# EAGLE design Stepper_CANBus_V2 (EAGLE 9.5.2)
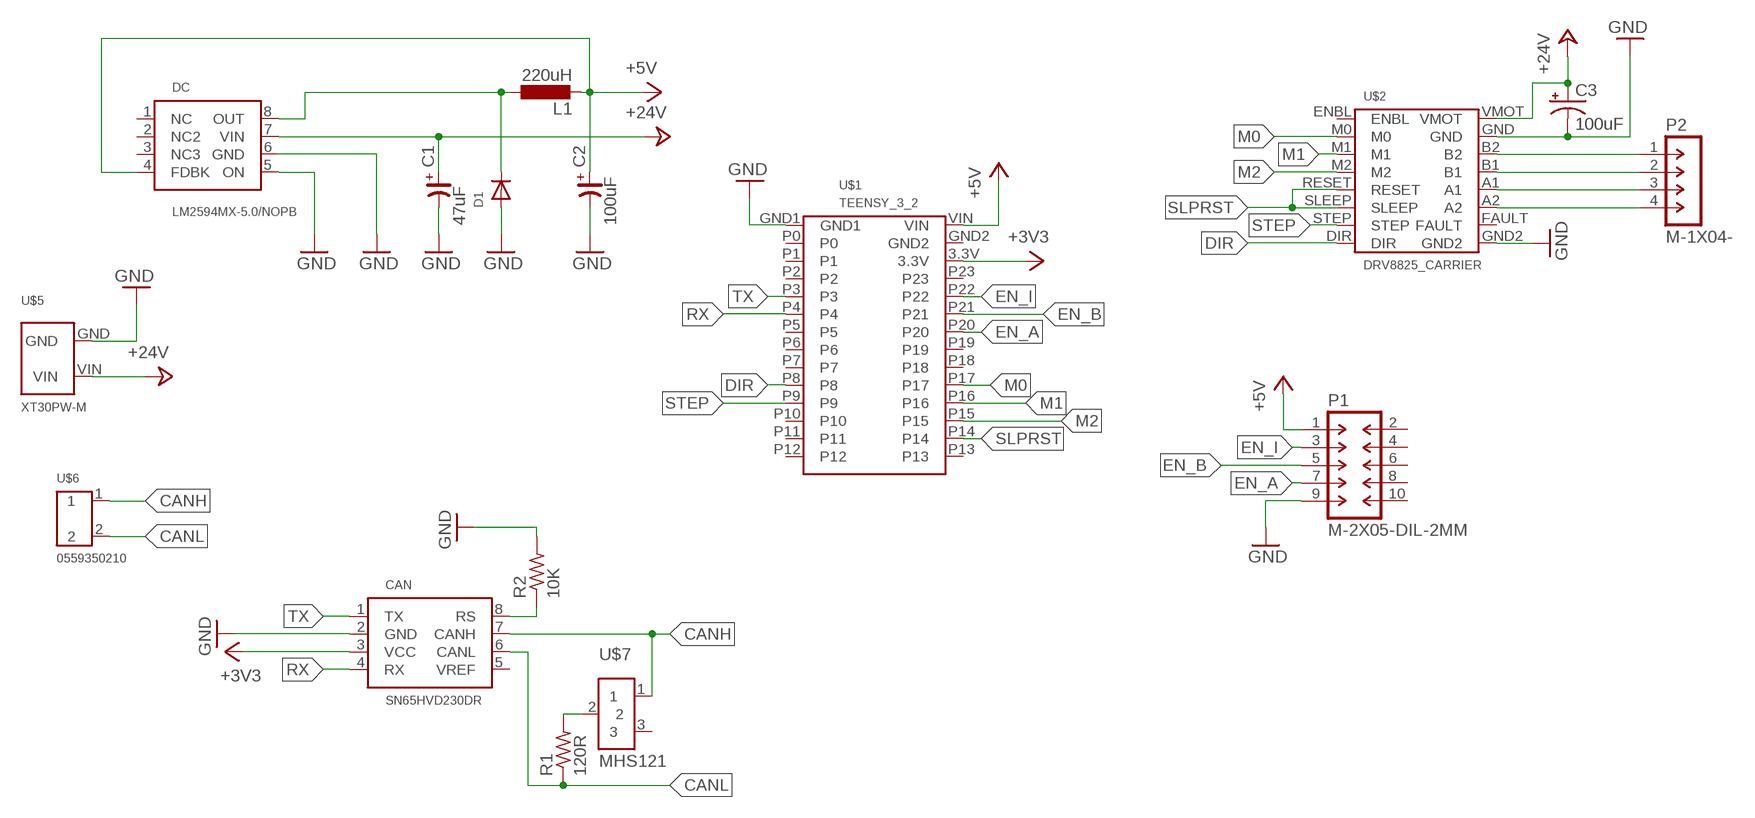
[diagram p0: schematic, sheet 1]

## Parts
C1  47uF  CP_7343  [C7343/T]
C2  100uF  CP_7343  [C7343/T]
C3  100uF  CPOL-USE2.5-7  [E2,5-7]
CAN  SN65HVD230DR  [SOIC8]
D1  DIODESOD-323F  [SOD-323F]
DC  LM2594MX-5.0/NOPB  [SOIC8]
L1  220uH  L-EUL4532C  [L4532M]
P1  M-2X05-DIL-2MM  [DIL-2MM-2X05]
P2  M-1X04-  [DIL-2MM-1X04]
R1  120R  R-US_R0603  [R0603]
R2  10K  R-US_R0603  [R0603]
U$1  TEENSY_3_2  [TEENSY_3_2]
U$2  DRV8825_CARRIER  [DRV8825_CARRIER]
U$5  XT30PW-M  [XT30PW-M]
U$6  0559350210  [0559350210]
U$7  MHS121  [MHS121]

## Nets
+3V3: CAN.3(VCC) U$1.3.3V
+5V: C2.+ DC.4(FDBK) L1.2 P1.1 U$1.VIN
+24V: C1.+ C3.+ DC.7(VIN) U$2.VMOT U$5.VIN
CANH: CAN.7(CANH) U$6.1 U$7.1
CANL: CAN.6(CANL) R1.1 U$6.2
DIR: U$1.P8 U$2.DIR
EN_A: P1.7 U$1.P20
EN_B: P1.5 U$1.P21
EN_I: P1.3 U$1.P22
GND: C1.- C2.- C3.- CAN.2(GND) D1.A DC.5(ON) DC.6(GND) P1.9 R2.2 U$1.GND1 U$2.GND U$2.GND2 U$5.GND
M0: U$1.P17 U$2.M0
M1: U$1.P16 U$2.M1
M2: U$1.P15 U$2.M2
N$1: CAN.8(RS) R2.1
N$2: D1.C DC.8(OUT) L1.1
N$3: P2.1 U$2.B2
N$4: R1.2 U$7.2
N$5: P2.2 U$2.B1
N$6: P2.3 U$2.A1
N$7: P2.4 U$2.A2
RX: CAN.4(RX) U$1.P4
SLPRST: U$1.P14 U$2.RESET U$2.SLEEP
STEP: U$1.P9 U$2.STEP
TX: CAN.1(TX) U$1.P3
Unconnected: CAN.5(VREF) DC.1(NC) DC.2(NC2) DC.3(NC3) P1.2 P1.4 P1.6 P1.8 P1.10 U$1.GND2 U$1.P0 U$1.P1 U$1.P2 U$1.P5 U$1.P6 U$1.P7 U$1.P10 U$1.P11 U$1.P12 U$1.P13 U$1.P18 U$1.P19 U$1.P23 U$2.ENBL U$2.FAULT U$7.3

## Library data of the parts
C1 C2 = rc-master:CP_: POLARIZED CAP
C3 = adafruit:CPOL-US: POLARIZED CAPACITOR, American symbol
CAN = Stepper_CANBus:SN65HVD230DR
D1 = adafruit:DIODE: Diode SMADIODE - SMA Surface Mount Package 20V 1A Schottky Diode Digikey: 641-1014-6-ND DO-1N4148 - Through Hole Small Current Diode SOD-123 20V 1 A (.5mV Vf) Schottky Diode - Digikey: MBRX120TPMSCT-ND SOD-323 10V 570mA (.38mV Vf, 3ns) Schottky Diode - Digikey: ZLLS410CT-ND SOD-523 30V 30mA Schottky Diode (RB751S-40TE61) - Digikey: RB751S-40TE61CT-ND SOT23-R/W - SOT23 Package (R = Solder Paste/Reflow Ovens, W = Hand-Soldering) BAT54Film 40V 300mA - Digikey: 497-7162-1-ND
DC = Stepper_CANBus:LM2594MX-5.0/NOPB
L1 = rcl:L-EU: INDUCTOR, European symbol; SPICEPREFIX: L
P1 = con-headers-jp:M-2X05-: MALE HEADER
P2 = con-headers-jp:M-1X04-: MALE HEADER
R1 R2 = adafruit:R-US_: RESISTOR, American symbol
U$1 = Stepper_CANBus:TEENSY_3_2
U$2 = Stepper_CANBus:DRV8825_CARRIER
U$5 = Stepper_CANBus:XT30PW-M
U$6 = Stepper_CANBus:0559350210
U$7 = Stepper_CANBus:MHS121

## Board
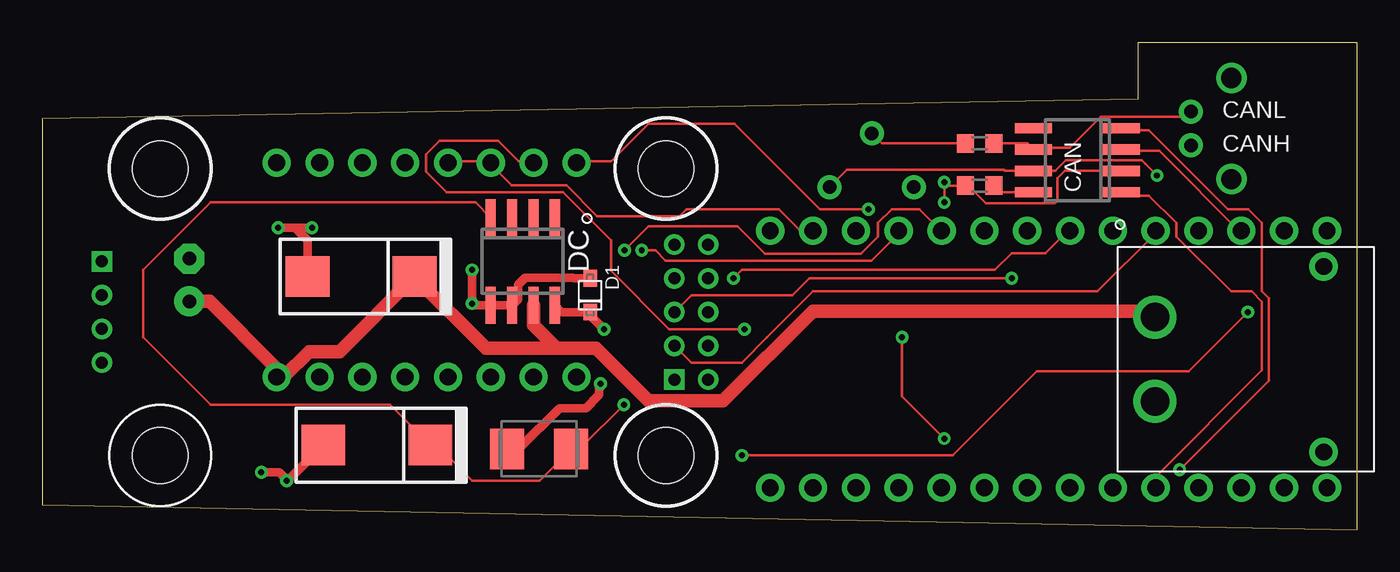
[diagram p1: board, top side]
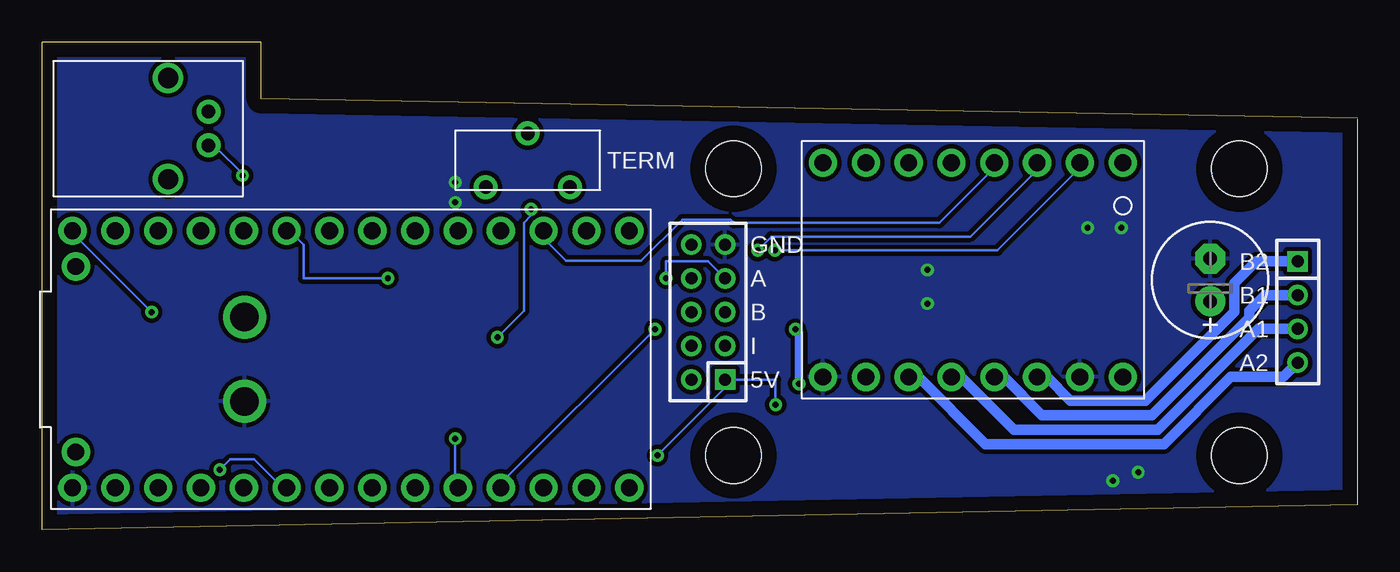
[diagram p2: board, bottom side, seen from below]

Size 78 x 28.91 mm. Coordinates in mm from the lower left corner, seen from the top.
Outline: 0,24.34 0,1.48 78,0 78,28.91 65,28.91 65,25.57 0,24.41
Copper layers (1*16): Top 0.035mm / dielectric 1.5mm / Bottom 0.035mm
Design rules "default *": minimum track width 6mil, minimum drill 0.35mm, track to track 10mil, track to pad 10mil, pad to pad 10mil, via to via 10mil, smd to smd 10mil, copper to edge 35mil, drill to drill 6mil, minimum pad ring 10mil, minimum via ring 8mil, stop-mask expansion 4mil, vias tented up to drill 0mil, thermal gap 10mil
Holes 3.3 mm at 7,21.41 7,4.41 37,21.41 37,4.41

### Footprints (pad centres in the part's own frame; a part is rotated, then mirrored left to right if it is on the bottom)
C7343/T = smd 2.6 x 2.4: + 3.175,0; - -3.175,0
E2,5-7 = drill 0.813 pad 1.778: + -1.27,0 | drill 0.813 pad 1.778 octagon: - 1.27,0
SOIC8 = smd 0.6 x 2.2: 1 -1.905,-2.6; 2 -0.635,-2.6; 3 0.635,-2.6; 4 1.905,-2.6; 5 1.905,2.6; 6 0.635,2.6; 7 -0.635,2.6; 8 -1.905,2.6
SOD-323F = smd 1 x 0.8: A -1,0; C 1,0
L4532M = smd 2 x 2.4: 1 -1.9,0; 2 1.9,0
DIL-2MM-2X05 = drill 0.711 square: 1 -4,-1 | drill 0.711: 2 -4,1; 3 -2,-1; 4 -2,1; 5 0,-1; 6 0,1; 7 2,-1; 8 2,1; 9 4,-1; 10 4,1
DIL-2MM-1X04 = drill 0.711 square: 1 -3,-1 | drill 0.711: 2 -1,-1; 3 1,-1; 4 3,-1
R0603 = smd 1 x 1.1: 1 -0.85,0; 2 0.85,0
TEENSY_3_2 = drill 1 pad 1.676: 3.3V 7.62,12.7; GND1 -7.62,17.78; GND2 7.62,15.24; P0 -7.62,15.24; P1 -7.62,12.7; P2 -7.62,10.16; P3 -7.62,7.62; P4 -7.62,5.08; P5 -7.62,2.54; P6 -7.62,0; P7 -7.62,-2.54; P8 -7.62,-5.08; P9 -7.62,-7.62; P10 -7.62,-10.16; P11 -7.62,-12.7; P12 -7.62,-15.24; P13 7.62,-15.24; P14 7.62,-12.7; P15 7.62,-10.16; P16 7.62,-7.62; P17 7.62,-5.08; P18 7.62,-2.54; P19 7.62,0; P20 7.62,2.54; P21 7.62,5.08; P22 7.62,7.62; P23 7.62,10.16; VIN 7.62,17.78
DRV8825_CARRIER = drill 1 pad 1.676: A1 6.35,-1.27; A2 6.35,-3.81; B1 6.35,1.27; B2 6.35,3.81; DIR -6.35,-8.89; ENBL -6.35,8.89; FAULT 6.35,-6.35; GND 6.35,6.35; GND2 6.35,-8.89; M0 -6.35,6.35; M1 -6.35,3.81; M2 -6.35,1.27; RESET -6.35,-1.27; SLEEP -6.35,-3.81; STEP -6.35,-6.35; VMOT 6.35,8.89
XT30PW-M = drill 1.7 pad 2.54: GND 2.5,-10; VIN -2.5,-10 | drill 1 pad 1.676: NC -5.5,0; NC2 5.5,0
0559350210 = drill 0.8 pad 1.422: 1 -1,0; 2 1,0 | drill 1.2: NC -3,2.4; NC1 3,2.4
MHS121 = drill 0.8 pad 1.422: 1 -2.5,1.6; 2 0,-1.6; 3 2.5,1.6

### Placement (x,y rotation side)
C1  18.92,15.02 0 top
C2  19.85,5.02 0 top
C3  8.73,14.81 90 bottom
CAN  61.39,21.91 90 top
D1  32.5,13.91 270 top
DC  28.5,15.91 180 top
L1  29.47,4.8 0 top
P1  38.5,12.91 90 bottom
P2  2.54,12.91 270 bottom
R1  55.6,22.91 180 top
R2  55.6,20.41 180 top
U$1  58.42,10.11 90 bottom
U$2  22.8,15.41 270 bottom
U$5  76,10.11 270 top
U$6  68.13,23.79 90 bottom
U$7  49.2,21.91 180 bottom

### Tracks (layer width: path | path; a pad name or v marks a point on that pad's centre or on a via)
+3V3
  Top 0.152: CAN.3 64.01,22.46 66.24,22.46 71.12,17.58 U$1.3.3V
+5V  (via drill 0.35)
  Top 0.152: DC.4 25.7,19.41 10,19.41 6,15.41 6,11.41 10,7.41 20.64,7.41 C2.+ 23.5,4.91 25.5,2.91 29.5,2.91 31,4.41 L1.2 31.5,4.91 32,4.91 v34.5,7.41 | v71.5,12.91 68,9.41 59,9.41 54,4.41 v41.5,4.41
  Bottom 0.152: v34.5,7.41 34.5,8.91 P1.1 37.5,8.41 v41.5,4.41 | v71.5,12.91 76,17.41 U$1.VIN
+24V
  Top 0.813: U$5.VIN 65.5,12.96 45.7,12.96 40.38,7.64 35.97,7.64 32.86,10.75 30.5,10.75 | 30.5,10.75 26.32,10.75 22.09,14.98 C1.+ 17.63,10.56 15.83,10.56 14.33,9.06 U$2.VMOT 13.91,9.56 9.93,13.54 C3.+ | 30.5,10.75 29.14,12.12 DC.7
CANH  (via drill 0.35)
  Top 0.152: U$7.1 47.74,21.35 57.03,21.35 57.1,21.27 CAN.7 60.08,21.27 60.71,21.91 65.23,21.91 65.42,21.71 65.42,21.7 v66.12,21.01
  Bottom 0.152: v66.12,21.01 66.12,21.12 67.67,22.66 68.07,22.66 U$6.1
CANL
  Top 0.152: U$6.2 68.07,24.7 67.87,24.49 62.79,24.49 60.96,22.66 58.93,22.66 CAN.6 58.42,22.91 R1.1
DIR  (via drill 0.35)
  Top 0.152: v49,19.01 46.13,19.01 41.05,24.09 35.97,24.09 33.73,21.85 31.7,21.85 U$2.DIR | v51,11.41 51,7.91 v53.5,5.41
  Bottom 0.152: v53.5,5.41 53.5,2.65 U$1.P8 | v49,19.01 49,18.64 49.43,18.21 49.43,12.98 v51,11.41
EN_A  (via drill 0.35)
  Top 0.152: v41,14.91 41.5,15.41 56.5,15.41 57.5,16.41 59.5,16.41 60.5,17.41 U$1.P20
  Bottom 0.152: P1.7 38.5,15.91 41,15.91 v41,14.91
EN_B  (via drill 0.35)
  Top 0.152: P1.5 38.5,13.91 44.5,13.91 45.5,14.91 v57.5,14.91
  Bottom 0.152: v57.5,14.91 62.5,14.91 62.5,16.91 63.5,17.91 U$1.P21
EN_I
  Top 0.152: 43,11.41 45.72,14.13 62.59,14.13 66.04,17.58 U$1.P22 | P1.3 38.5,9.91 41.5,9.91 43,11.41 | 43,11.41
GND  (via drill 0.35)
  Top 0.152: 31.5,14.94 32.31,14.94 D1.A | CAN.2 60.66,21.27 60.22,20.84 60.22,19.57 60.03,19.38 55.97,19.38 54.93,20.41 R2.2 53.7,20.41 v53.5,20.61 v53.5,19.41
  Top 0.508: v25.5,15.41 v25.5,13.41 25.6,13.31 DC.5 DC.6 28.22,13.67 28.22,14.51 28.65,14.94 31.5,14.94 31.53,14.91 D1.A | v14,17.91 15,17.91 | 15,17.91 v16,17.91 | 15,17.91 15.74,17.16 C1.- | C2.- 14.56,2.91 | 14.56,2.91 v14.5,2.91 | v13,3.41 14.06,3.41 14.56,2.91
  pour Bottom: 99.06,30.65 -2.54,30.65 -2.54,-2.33 99.06,-2.33
M0  (via drill 0.35)
  Top 0.152: v34.54,16.57 35.97,17.99 41.25,17.99 42.88,16.36 48.56,16.36 49.58,17.38 49.58,18.19 50.39,19.01 52.02,19.01 53.24,17.79 U$1.P17
  Bottom 0.152: v34.54,16.57 21.34,16.57 16.87,21.04 16.87,21.24 16.46,21.65 U$2.M0
M1  (via drill 0.35)
  Top 0.152: v35.56,16.57 36.37,16.57 36.98,15.96 49.17,15.96 50.8,17.58 U$1.P16
  Bottom 0.152: v35.56,16.57 34.75,17.38 22.96,17.38 19.1,21.24 19.1,21.65 U$2.M1
M2
  Bottom 0.152: U$1.P15 48.16,17.58 48.16,17.18 46.94,15.96 42.47,15.96 40.03,18.4 37.19,18.4 36.98,18.19 24.79,18.19 21.34,21.65 U$2.M2
N$1
  Top 0.152: CAN.8 56.85,20 R2.1
N$2  (via drill 0.35)
  Top 0.152: 32.31,12.91 30.68,12.91 30.48,13.11 DC.8 | 32.31,12.91 v33.33,11.89 | 32.31,12.91 D1.C
  Top 0.508: DC.8 30.8,12.91 D1.C 32.5,12.72 v33.33,11.89 | L1.1 28.26,4.8 30.68,7.21 32.25,7.21 33.04,8 33.04,8.66 v33.12,8.66
  Bottom 0.508: v33.12,8.66 33.12,11.69 v33.33,11.89
N$3
  Bottom 0.61: U$2.B2 18.43,9.06 17.03,7.66 12.56,7.66 7.28,12.94 7.28,14.63 6,15.91 P2.1
N$4
  Top 0.152: U$7.2 49.8,22.91 R1.2
N$5
  Bottom 0.61: U$2.B1 20.97,9.06 18.7,6.8 12.2,6.8 6.42,12.58 6.42,12.99 5.5,13.91 P2.2
N$6
  Bottom 0.61: U$2.A1 23.51,9.06 20.38,5.94 11.84,5.94 5.87,11.91 P2.3
N$7
  Bottom 0.61: P2.4 4.39,9.06 7.5,9.06 11.49,5.07 22.06,5.07 26.05,9.06 U$2.A2
RX  (via drill 0.35)
  Top 0.152: v67.46,3.56 72.75,8.85 72.75,13.72 72.34,14.13 72.34,18.19 71.53,19.01 70.31,19.01 65.63,23.68 64.01,23.68 CAN.4
  Bottom 0.152: v67.46,3.56 66.85,4.17 65.43,4.17 63.6,2.34 U$1.P4
SLPRST
  Top 0.152: U$2.RESET 24.18,21.85 26.42,21.85 U$2.SLEEP 26.62,21.65 27.84,20.43 31.09,20.43 32.92,18.6 37.8,18.6 38.2,19.01 43.69,19.01 44.91,17.79 45.72,17.79 U$1.P14
STEP  (via drill 0.35)
  Top 0.152: v41.66,11.89 37.19,11.89 33.73,15.35 33.73,17.18 30.89,20.02 23.98,20.02 22.76,21.24 22.76,22.26 23.57,23.07 27.03,23.07 28.25,21.85 29.06,21.85 U$2.STEP
  Bottom 0.152: v41.66,11.89 50.8,2.75 U$1.P9
TX
  Top 0.152: U$1.P3 66.04,3.16 72.34,9.46 72.34,13.52 71.73,14.13 70.51,14.13 67.26,17.38 67.26,18.19 65.63,19.82 64.01,19.82 CAN.1

### Text on the board
tPlace: CANL | CANH
bPlace: TERM | GND | B2 | A | B1 | B | A1 | I | A2 | 5V